# Altium schematic sheet power.SchDoc
size A4; SheetNumber: 2; SheetTotal: 2
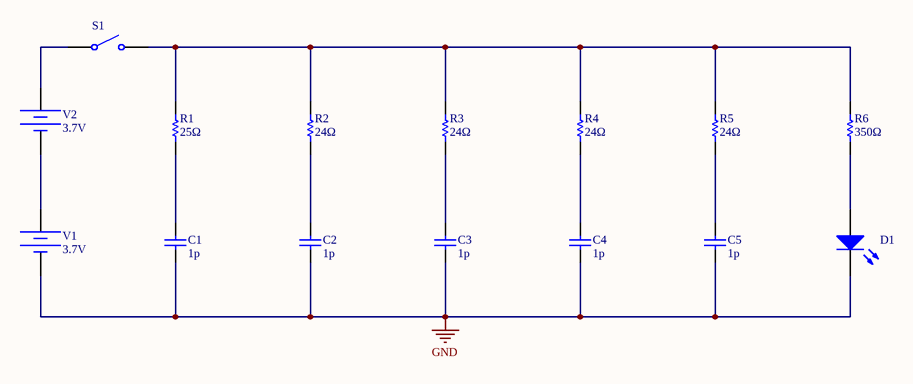
[diagram p0: power.SchDoc]

## Parts
C1  value 1p  (hidden comment: Capacitor)
C2  value 1p  (hidden comment: Capacitor)
C3  value 1p  (hidden comment: Capacitor)
C4  value 1p  (hidden comment: Capacitor)
C5  value 1p  (hidden comment: Capacitor)
D1  Light-Emitting Diode  (value not drawn)
R1  value 25Ω  (hidden comment: Resistor)
R2  value 24Ω  (hidden comment: Resistor)
R3  value 24Ω  (hidden comment: Resistor)
R4  value 24Ω  (hidden comment: Resistor)
R5  value 24Ω  (hidden comment: Resistor)
R6  value 350Ω  (hidden comment: Resistor)
S1  Single-Pole, Single-Throw Switch  (value not drawn)
V1  DC Magnitude: 3.7V  (hidden comment: Constant Voltage Source)
V2  DC Magnitude: 3.7V  (hidden comment: Constant Voltage Source)

## Nets
GND: C1.1 C2.1 C3.1 C4.1 C5.1 D1.2(K) V1.2
NetC1_2: C1.2 R1.1
NetC2_2: C2.2 R2.1
NetC3_2: C3.2 R3.1
NetC4_2: C4.2 R4.1
NetC5_2: C5.2 R5.1
NetD1_1: D1.1(A) R6.1
NetR1_2: R1.2 R2.2 R3.2 R4.2 R5.2 R6.2 S1.2
NetS1_1: S1.1 V2.1
NetV1_1: V1.1 V2.2

## Library data of the parts
C1-C5 = Capacitor: SimulationGenericComponent: True
D1 = LED: AF: 1; BV: 0; BV_MAX: 1e99; EG: 1.11; FC: 0.5; IBV: 0.001; IS: 1e-14; MJSW: 0.33; NTUN: 30; TNOM: 27; XTI: 3; SimulationGenericComponent: True; CJO: 0; CJP: 0; CTA: 0; CTP: 0; FCS: 0.5; FV_MAX: 1e99; IKF: 0; IKR: 0; ISR: 1e-14; JSW: 0; JTUN: 0; JTUNSW: 0; KEG: 1; KF: 0; LEVEL: 1; N: 1; NBV: 1; NR: 1; NS: 1; PHP: 1; RS: 0; TCV: 0; TLEV: 0; TLEVC: 0; TM1: 0; TM2: 0; TPB: 0; TPHP: 0; TRS: 0; TRS2: 0; TT: 0; TTT1: 0; TTT2: 0; VJ: 1; XTITUN: 3
R1-R6 = Resistor: TC1: 0; SimulationGenericComponent: True; TC2: 0
S1 = SPST SW: closed: 0; Rclosed: 1m; Ropen: 1Meg; SimulationGenericComponent: True
V1 V2 = Battery: SimulationGenericComponent: True